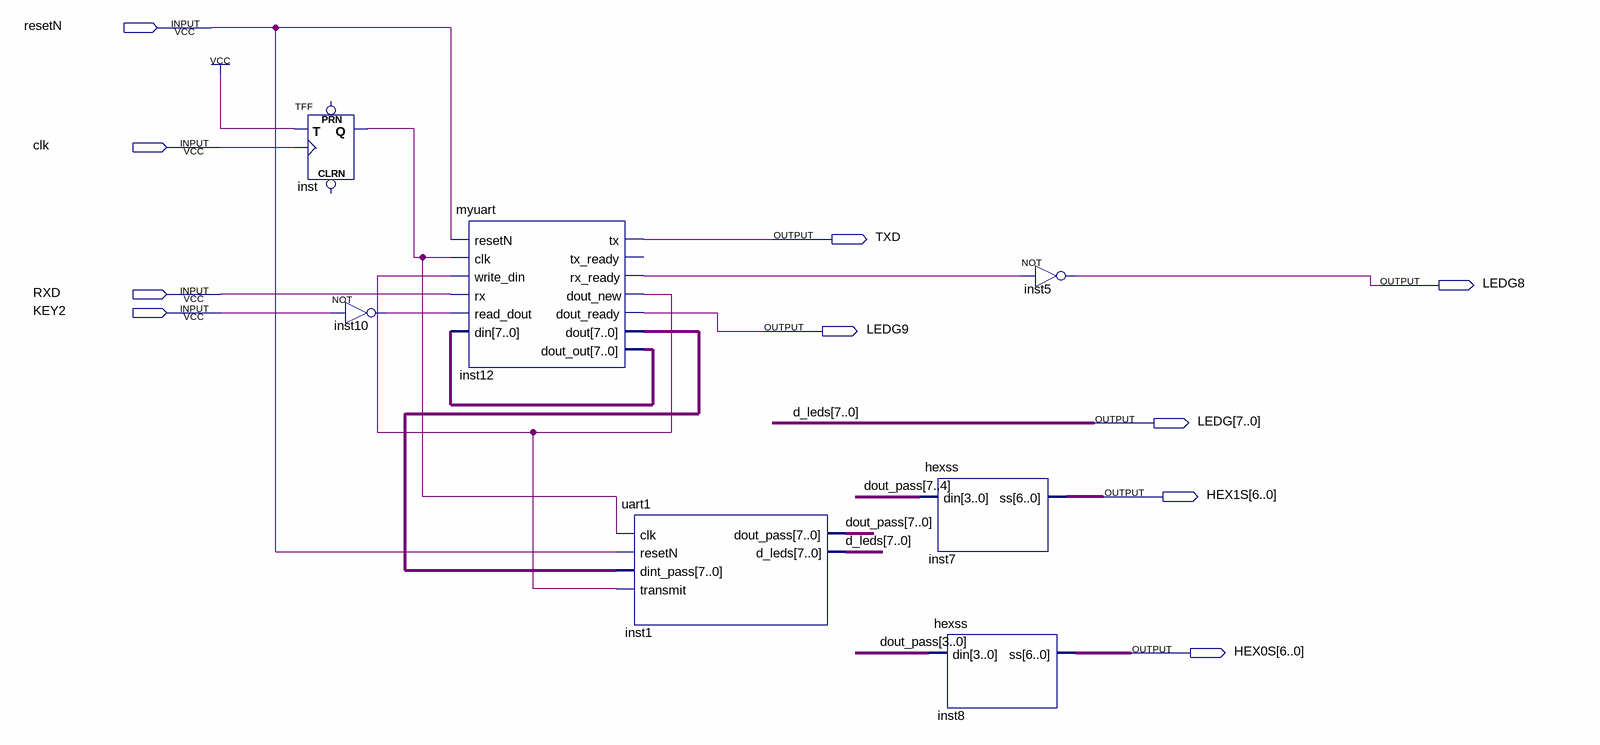
[diagram p0: schematic sheet]
// Quartus schematic UART.bdf as structural Verilog: 7 symbols, 10 pins
module UART (
  input  resetN,
  input  clk,
  input  RXD,
  input  KEY2,
  output TXD,
  output LEDG8,
  output LEDG9,
  output [7:0] LEDG,
  output [6:0] HEX1S,
  output [6:0] HEX0S
);

  wire inst10_out, inst12_dout_new, inst12_rx_ready, inst_q;
  wire [7:0] dout_pass, inst12_dout, inst12_dout_out;

  TFF inst (.T(1'b1), .CLK(clk), .Q(inst_q));  // open: PRN, CLRN
  not inst10 (inst10_out, KEY2);
  myuart inst12 (
    .resetN(resetN), .clk(inst_q), .write_din(inst12_dout_new), .rx(RXD), .read_dout(inst10_out),
    .din(inst12_dout_out), .tx(TXD), .rx_ready(inst12_rx_ready), .dout_new(inst12_dout_new),
    .dout_ready(LEDG9), .dout(inst12_dout), .dout_out(inst12_dout_out));  // open: tx_ready
  uart1 inst1 (
    .clk(inst_q), .resetN(resetN), .dint_pass(inst12_dout), .transmit(inst12_dout_new),
    .dout_pass(dout_pass), .d_leds(LEDG));
  hexss inst7 (.din(dout_pass[7:4]), .ss(HEX1S));
  hexss inst8 (.din(dout_pass[3:0]), .ss(HEX0S));
  not inst5 (LEDG8, inst12_rx_ready);

  // Other names for the same wires on the sheet: d_leds[7:0] = LEDG
endmodule
